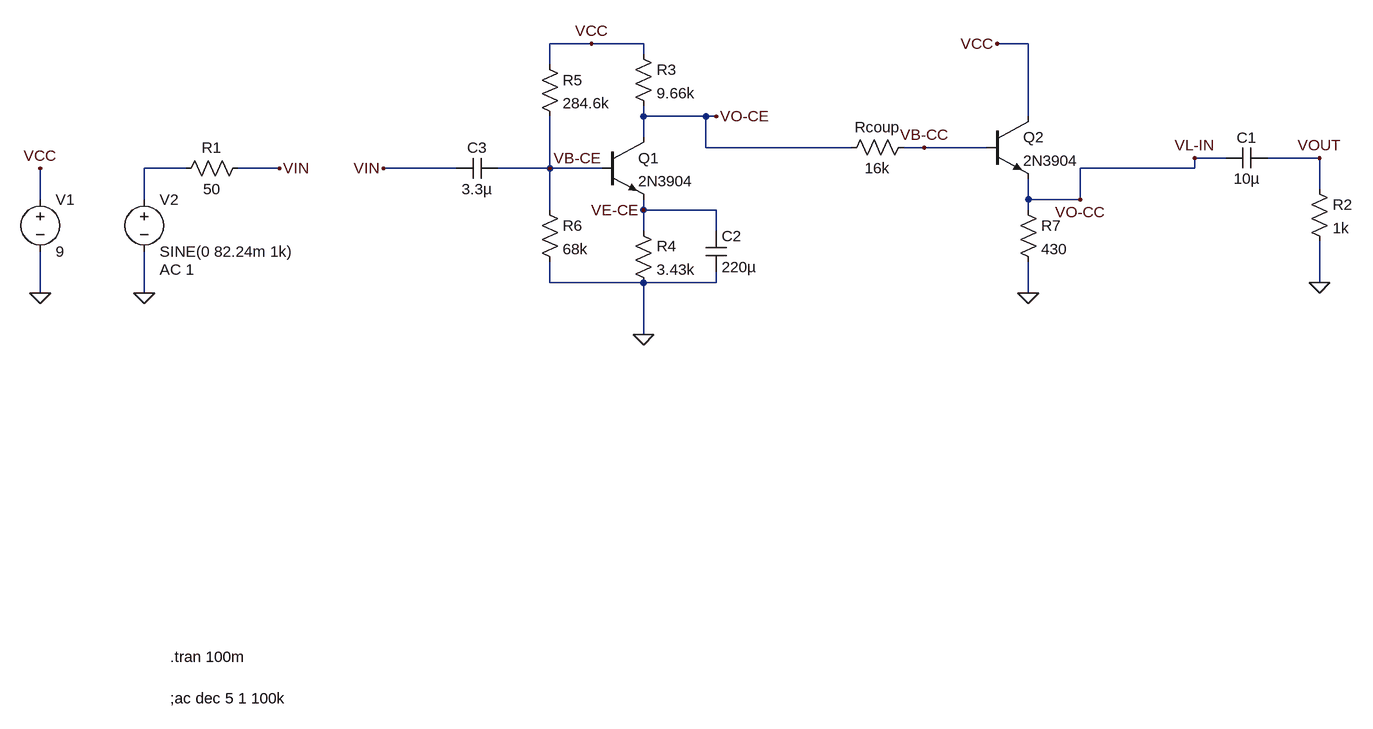
[diagram p0: schematic lab6.asc]
lab6.asc, the LTspice schematic file:
Version 4
SHEET 1 1304 1712
WIRE -64 688 -128 688
WIRE 16 688 -64 688
WIRE 608 688 560 688
WIRE 16 704 16 688
WIRE -128 720 -128 688
WIRE 16 800 16 784
WIRE 112 800 16 800
WIRE 128 800 112 800
WIRE 608 800 608 688
WIRE 16 832 16 800
WIRE 112 848 112 800
WIRE 336 848 112 848
WIRE 448 848 416 848
WIRE 544 848 448 848
WIRE 912 864 864 864
WIRE 1056 864 976 864
WIRE -688 880 -752 880
WIRE -544 880 -608 880
WIRE -272 880 -384 880
WIRE -128 880 -128 800
WIRE -128 880 -208 880
WIRE -48 880 -128 880
WIRE 864 880 864 864
WIRE 864 880 688 880
WIRE 1056 912 1056 864
WIRE -912 928 -912 880
WIRE -752 928 -752 880
WIRE 608 928 608 896
WIRE 688 928 688 880
WIRE 688 928 608 928
WIRE -128 944 -128 880
WIRE 16 944 16 928
WIRE 128 944 16 944
WIRE 608 944 608 928
WIRE 16 976 16 944
WIRE 128 976 128 944
WIRE -128 1056 -128 1024
WIRE 16 1056 -128 1056
WIRE 128 1056 128 1040
WIRE 128 1056 16 1056
WIRE 1056 1056 1056 992
WIRE -912 1072 -912 1008
WIRE -752 1072 -752 1008
WIRE 608 1072 608 1024
WIRE 16 1136 16 1056
FLAG -912 1072 0
FLAG -912 880 VCC
FLAG -752 1072 0
FLAG -544 880 VIN
FLAG 1056 1056 0
FLAG 864 864 VL-IN
FLAG 16 1136 0
FLAG -64 688 VCC
FLAG 16 944 VE-CE
FLAG 128 800 VO-CE
FLAG -128 880 VB-CE
FLAG -384 880 VIN
FLAG 1056 864 VOUT
FLAG 560 688 VCC
FLAG 608 1072 0
FLAG 688 928 VO-CC
FLAG 448 848 VB-CC
SYMBOL voltage -912 912 R0
WINDOW 123 0 0 Left 0
WINDOW 39 0 0 Left 0
SYMATTR InstName V1
SYMATTR Value 9
SYMBOL voltage -752 912 R0
WINDOW 123 24 124 Left 2
WINDOW 39 0 0 Left 0
SYMATTR Value2 AC 1
SYMATTR InstName V2
SYMATTR Value SINE(0 82.24m 1k)
SYMBOL res -592 864 R90
WINDOW 0 0 56 VBottom 2
WINDOW 3 32 56 VTop 2
SYMATTR InstName R1
SYMATTR Value 50
SYMBOL cap 976 848 R90
WINDOW 0 0 32 VBottom 2
WINDOW 3 32 32 VTop 2
SYMATTR InstName C1
SYMATTR Value 10µ
SYMBOL res 1040 896 R0
SYMATTR InstName R2
SYMATTR Value 1k
SYMBOL npn -48 832 R0
SYMATTR InstName Q1
SYMATTR Value 2N3904
SYMBOL res -144 928 R0
SYMATTR InstName R6
SYMATTR Value 68k
SYMBOL res -144 704 R0
SYMATTR InstName R5
SYMATTR Value 284.6k
SYMBOL res 0 960 R0
SYMATTR InstName R4
SYMATTR Value 3.43k
SYMBOL res 0 688 R0
SYMATTR InstName R3
SYMATTR Value 9.66k
SYMBOL cap 112 976 R0
SYMATTR InstName C2
SYMATTR Value 220µ
SYMBOL cap -208 864 R90
WINDOW 0 0 32 VBottom 2
WINDOW 3 32 32 VTop 2
SYMATTR InstName C3
SYMATTR Value 3.3µ
SYMBOL npn 544 800 R0
SYMATTR InstName Q2
SYMATTR Value 2N3904
SYMBOL res 592 928 R0
SYMATTR InstName R7
SYMATTR Value 430
SYMBOL res 432 832 R90
WINDOW 0 0 56 VBottom 2
WINDOW 3 32 56 VTop 2
SYMATTR InstName Rcoup
SYMATTR Value 16k
TEXT -712 1696 Left 2 !;ac dec 5 1 100k
TEXT -712 1632 Left 2 !.tran 100m

The netlist it stands for:
* lab6.asc
V1 VCC 0 9
V2 N001 0 SINE(0 82.24m 1k) AC 1
R1 VIN N001 50
C1 VOUT VO-CC 10µ
R2 VOUT 0 1k
Q1 VO-CE VB-CE VE-CE 0 2N3904
R6 VB-CE 0 68k
R5 VCC VB-CE 284.6k
R4 VE-CE 0 3.43k
R3 VCC VO-CE 9.66k
C2 VE-CE 0 220µ
C3 VB-CE VIN 3.3µ
Q2 VCC VB-CC VO-CC 0 2N3904
R7 VO-CC 0 430
Rcoup VB-CC VO-CE 16k
.model NPN NPN
.model PNP PNP
.lib standard.bjt
;ac dec 5 1 100k
.tran 100m
.backanno
.end